# EAGLE design slush_cap_board_hardctrl rev_C (EAGLE 8.5.0)
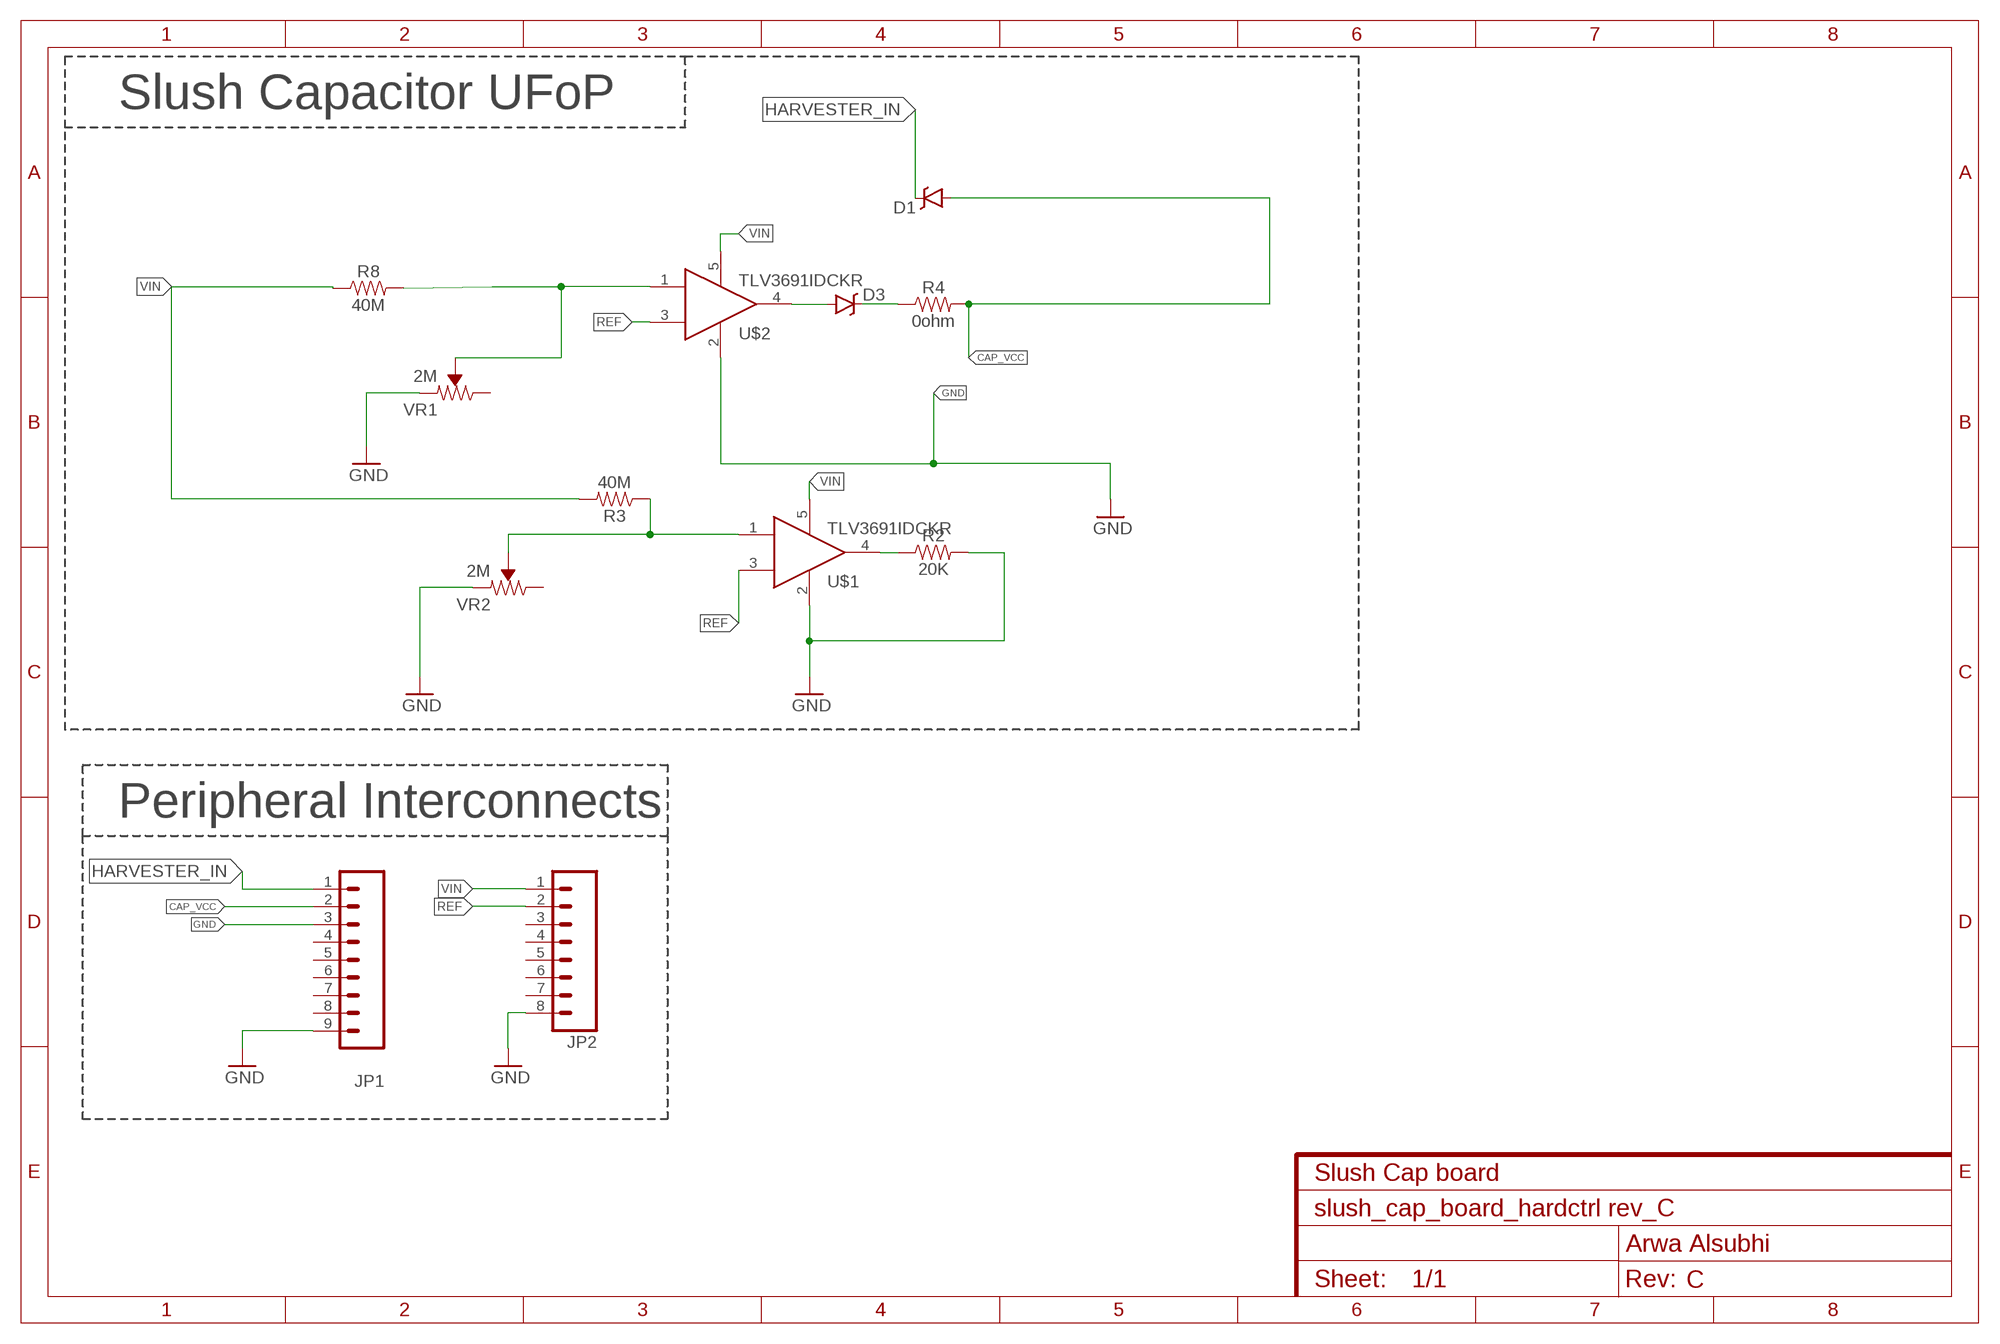
[diagram p0: schematic, sheet 1]
FRAME2 (FRAME-A4L): CNAME: Slush Cap board; CREVISION: C; DESIGNER: Arwa Alsubhi

## Parts
D1  RB751  DIODE-SCHOTTKY-RB751  [SOD-523]
D3  RB751  DIODE-SCHOTTKY-RB751  [SOD-523]
JP1  M091.27MM  [1X09-1.27MM]
JP2  M081.27MM  [1X08-1.27MM]
R2  20K  0.3OHM-0805-1/8W-1%  [0805]
R3  40M  0.3OHM-0805-1/8W-1%  [0805]
R4  0ohm  0603-RESISTOR-0603-1/10W-1%  [0603]
R8  40M  0.3OHM-0805-1/8W-1%  [0805]
U$1  TLV3691IDCKR  [SOT353]
U$2  TLV3691IDCKR  [SOT353]
VR1  2M  TRIMPOT-SMD-3MM-CLOSED-1/8W-20%  [TRIMPOT-SMD-3MM-CLOSED]
VR2  2M  TRIMPOT-SMD-3MM-CLOSED-1/8W-20%  [TRIMPOT-SMD-3MM-CLOSED]

## Nets
CAP_VCC: D1.A JP1.2 R4.2
GND: JP1.3 JP1.9 JP2.8 R2.2 U$1.2 U$2.2 VR1.1(CCW) VR2.1(CCW)
HARVESTER_IN: D1.C JP1.1
N$1: D3.A U$2.4
N$2: R2.1 U$1.4
N$4: R8.2 U$2.1 VR1.2(WIPER)
N$5: R3.1 U$1.1 VR2.2(WIPER)
N$7: D3.C R4.1
REF: JP2.2 U$1.3 U$2.3
VIN: JP2.1 R3.2 R8.1 U$1.5 U$2.5
Unconnected: JP1.4 JP1.5 JP1.6 JP1.7 JP1.8 JP2.3 JP2.4 JP2.5 JP2.6 JP2.7 VR1.3(CW) VR2.3(CW)

## Notes on the sheet
- Slush Capacitor UFoP
- Peripheral Interconnects

## Library data of the parts
D1 D3 = SparkFun-DiscreteSemi:DIODE-SCHOTTKY: Schottky diodes in SFE's production catalog BAT20J 1A 23V 0.62Vf RB751 120mA 40V 0.37Vf PMEG4005EJ 0.5A 40V 0.42Vf MBRA140 1A 40V 0.5Vf B340A 3A 40V SMA; DIGIKEY: BAS40-02V-V-G-08GICT-ND; MPN: BAS40-02V-V-G-08; PROD_ID: DIO-11018
JP1 = SparkFun-Connectors:M09: Header 9 Standard 9-pin 0.1" header. Use with straight break away headers (SKU : PRT-00116), right angle break away headers (PRT-00553), swiss pins (PRT-00743), machine pins (PRT-00117), and female headers (PRT-00115).; DIGIKEY: S9014E-09-ND; MANUFACTURERPARTNUMBER: GRPB091VWVN-RC; MPN: GRPB091VWVN-RC
JP2 = SparkFun-Connectors:M08: Header 8 Standard 8-pin 0.1" header. Use with straight break away headers (SKU : PRT-00116), right angle break away headers (PRT-00553), swiss pins (PRT-00743), machine pins (PRT-00117), and female headers (PRT-00115).; DIGIKEY: S9014E-08-ND; MANUFACTURERPARTNUMBER: GRPB081VWVN-RC; MPN: GRPB081VWVN-RC
R2 R3 R8 = SparkFun-Resistors:0.3OHM: 0.3Ω resistor A resistor is a passive two-terminal electrical component that implements electrical resistance as a circuit element. Resistors act to reduce current flow, and, at the same time, act to lower voltage levels within circuits. - Wikipedia; PROD_ID: RES-11622; VALUE: 0.3
R4 = Arwa_lib:0603-RESISTOR: resistor A resistor is a passive two-terminal electrical component that implements electrical resistance as a circuit element. Resistors act to reduce current flow, and, at the same time, act to lower voltage levels within circuits. - Wikipedia; PROD_ID: RES-08787
U$1 U$2 = Arwa_lib:TLV3691IDCKR
VR1 VR2 = SparkFun-Resistors:TRIMPOT: Trimming Potentiometer (Trimpot) Three-terminal potentiometers, with an adjustable wiper and two adjustable resistors. A pot can be used to create a configurable voltage divider, or as a variable resistor. "Trimpots" are a subset of potentiometers, usually intended for "set-and-forget" applications. They're often more delicate than standard potentiometers - rated for fewer turns. Variants PTH-KNOB - PTH Trimpot w/ finger-adjustable knob Trimpot 10K with Knob <https://www.sparkfun.com/products/9806> (COM-09806) Datasheet <http://www.sparkfun.com/datasheets/Components/General/TSR-3386.pdf> SMD-3MM-CLOSED-FRAME - SMD 3mm Square Closed-Frame Trimpot Used on e.g. EasyDriver - Stepper Motor Driver <https://www.sparkfun.com/products/12779> Datasheet <http://www.bitechnologies.com/pdfs/22.pdf> (22AR10KTR) SMD-5MM - SMD 5mm Square Closed-Frame Trimpot Used on e.g. IOIO-OTG - V2.2 <https://www.sparkfun.com/products/13613> Datasheet <http://www.vishay.com/docs/51008/ts53.pdf> (TS53YL502MR10) SMD-3MM-1/10W-25% - 3mm Square Open-Frame Trimpot Used on e.g. SparkFun Shapeoko <https://www.sparkfun.com/products/13899> Datasheet <http://www.bourns.com/docs/Product-Datasheets/TC33.pdf> (TC33X-2-103E); PROD_ID: RES-09285; VALUE: 10k

## Board
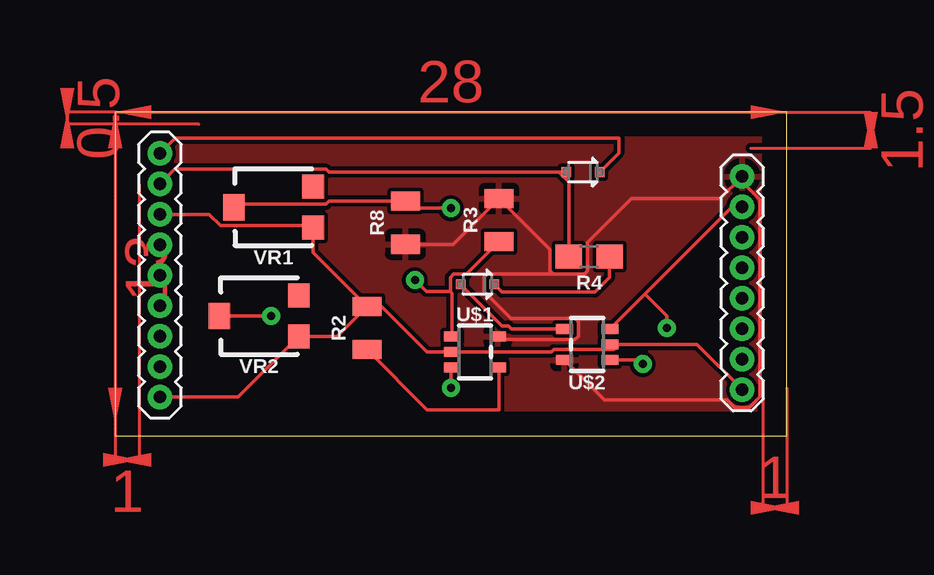
[diagram p1: board, top side]
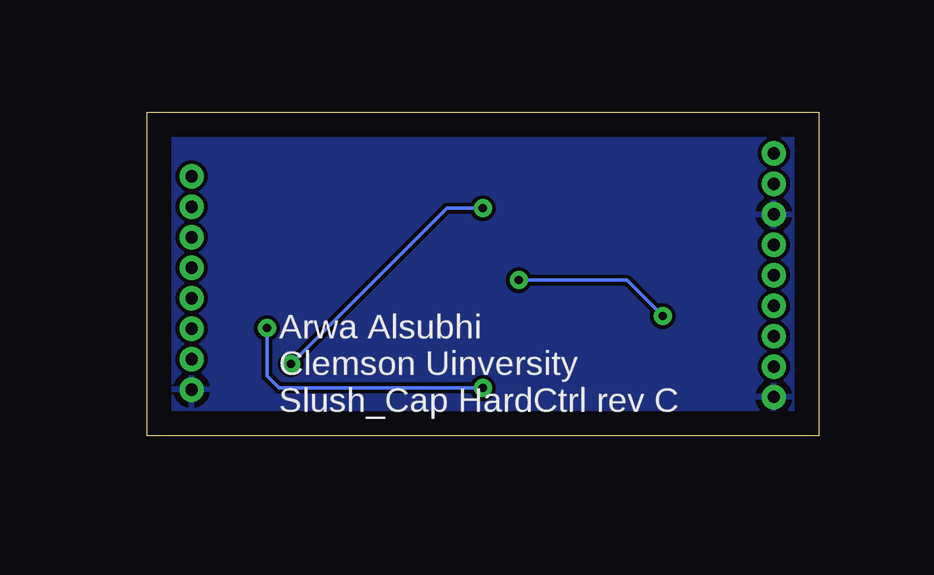
[diagram p2: board, bottom side, seen from below]

Size 28 x 13.5 mm. Coordinates in mm from the lower left corner, seen from the top.
Outline: 0,0 28,0 28,13.5 0,13.5 0,0
Copper layers (1*16): Top 0.035mm / dielectric 1.5mm / Bottom 0.035mm
Design rules "default": minimum track width 6mil, minimum drill 0.35mm, track to track 6mil, track to pad 6mil, pad to pad 6mil, via to via 6mil, smd to smd 6mil, copper to edge 40mil, drill to drill 6mil, minimum pad ring 10mil, minimum via ring 8mil, stop-mask expansion 4mil, vias tented up to drill 0mil, thermal gap 10mil

### Footprints (pad centres in the part's own frame; a part is rotated, then mirrored left to right if it is on the bottom)
SOD-523 = smd 0.4 x 0.4: A -0.7,0; C 0.7,0
1X09-1.27MM = drill 0.508 pad 1: 1 0,0; 2 1.27,0; 3 2.54,0; 4 3.81,0; 5 5.08,0; 6 6.35,0; 7 7.62,0; 8 8.89,0; 9 10.16,0
1X08-1.27MM = drill 0.508 pad 1: 1 0,0; 2 1.27,0; 3 2.54,0; 4 3.81,0; 5 5.08,0; 6 6.35,0; 7 7.62,0; 8 8.89,0
0805 = smd 0.8 x 1.2: 1 -0.9,0; 2 0.9,0
0603 = smd 1.1 x 1: 1 -0.85,0; 2 0.85,0
SOT353 = smd 0.42 x 0.7: 1 -0.65,-0.95; 2 0,-0.95; 3 0.65,-0.95; 4 0.65,0.95; 5 -0.65,0.95
TRIMPOT-SMD-3MM-CLOSED = smd 1 x 0.9: 1 -0.85,-1.65; 3 0.85,-1.65 | smd 1.1 x 0.9: 2 0,1.65

### Placement (x,y rotation side)
D1  19.5,11 0 top
D3  15.1,6.32 0 top
JP1  1.87,11.78 270 top
JP2  26.14,10.82 270 top
R2  10.5,4.5 90 top
R3  16,9 90 top
R4  19.76,7.47 180 top
R8  12.1,8.89 90 top
U$1  15,3.5 270 top
U$2  19.68,3.81 90 top
VR1  6.6,9.54 90 top
VR2  6,5 90 top

### Tracks (layer width: path | path; a pad name or v marks a point on that pad's centre or on a via)
CAP_VCC
  Top 0.152: D1.A 18.5,11 | 18.5,11 8.91,11 8.79,11.12 2.48,11.12 JP1.2 | R4.2 18.91,10.59 18.5,11
GND
  Top 0.152: 2.18,1.62 JP1.9 5.12,1.62 VR2.1 9.25,4.15 R2.2 | JP1.3 3.93,9.24 4.41,8.76 8.18,8.76 VR1.1 8.25,7.65 R2.2 | U$2.2 21,3.81 | 21,3.81 24.26,3.81 JP2.8 | R2.2 11.1,5.4 13,3.5 U$1.2 18.19,3.5 18.29,3.6 20.79,3.6 21,3.81
  pour Bottom: 0,14 28,14 28,0 0,0
HARVESTER_IN
  Top 0.152: JP1.1 2.5,12.41 21,12.41 21,11.8 D1.C
N$1
  Top 0.152: D3.A 16.13,4.59 16.39,4.59 16.52,4.46 U$2.4
N$2
  Top 0.152: R2.1 13.01,1.09 16,1.09 16,2.8 U$1.4
N$4  (via drill 0.35)
  Top 0.152: R8.2 12,9.79 | 12,9.79 8.92,9.79 8.79,9.66 5.07,9.66 VR1.2 | U$2.1 21.84,3.16 v22,3 | v14,9.5 12.29,9.5 12,9.79
  Bottom 0.152: v22,3 15.5,9.5 v14,9.5
N$5  (via drill 0.35)
  Top 0.152: U$1.1 14.05,5.95 13.97,6.03 | 13.97,6.03 13.97,6.62 14.11,6.75 14.65,6.75 R3.1 | 13.97,6.03 12.97,6.03 v12.5,6.5 | v6.5,5 VR2.2
  Bottom 0.152: v12.5,6.5 8,6.5 v6.5,5
N$7
  Top 0.152: R4.1 20.61,6.61 20,6 16.12,6 D3.C
REF  (via drill 0.35)
  Top 0.152: U$2.3 22.09,5.92 | 22.09,5.92 25.72,9.55 JP2.2 | U$1.3 14,2.8 v14,2 | v23,4.5 23,5 22.09,5.92
  Bottom 0.152: v14,2 22.5,2 23,2.5 v23,4.5
VIN
  Top 0.152: R8.1 14.09,7.99 R3.2 18.13,7.77 18.13,6.88 18.27,6.74 | 18.27,6.74 19.55,6.74 19.69,6.88 19.69,8.06 21.52,9.9 25.22,9.9 JP2.1 26.14,10.59 26.88,9.86 26.88,1.62 26.45,1.19 25.84,1.19 25.53,1.5 20.39,1.5 U$2.5 | 18.27,6.74 16.1,6.74 16.09,6.75 15.51,6.75 15.37,6.62 15.37,6.03 16.5,4.9 19.18,4.9 19.31,4.76 19.31,4.16 19.18,4.02 16.09,4.02 U$1.5
  pour Top: 0,14 28,14 28,-0.5 0,-0.5
(copper drawn outside any net)
  shapes: Top area x6

### Text on the board
bNames: Arwa Alsubhi / Clemson Uinversity / Slush_Cap HardCtrl rev C